# EAGLE design modular_expansion_basic_joystick_only (EAGLE 9.2.1)
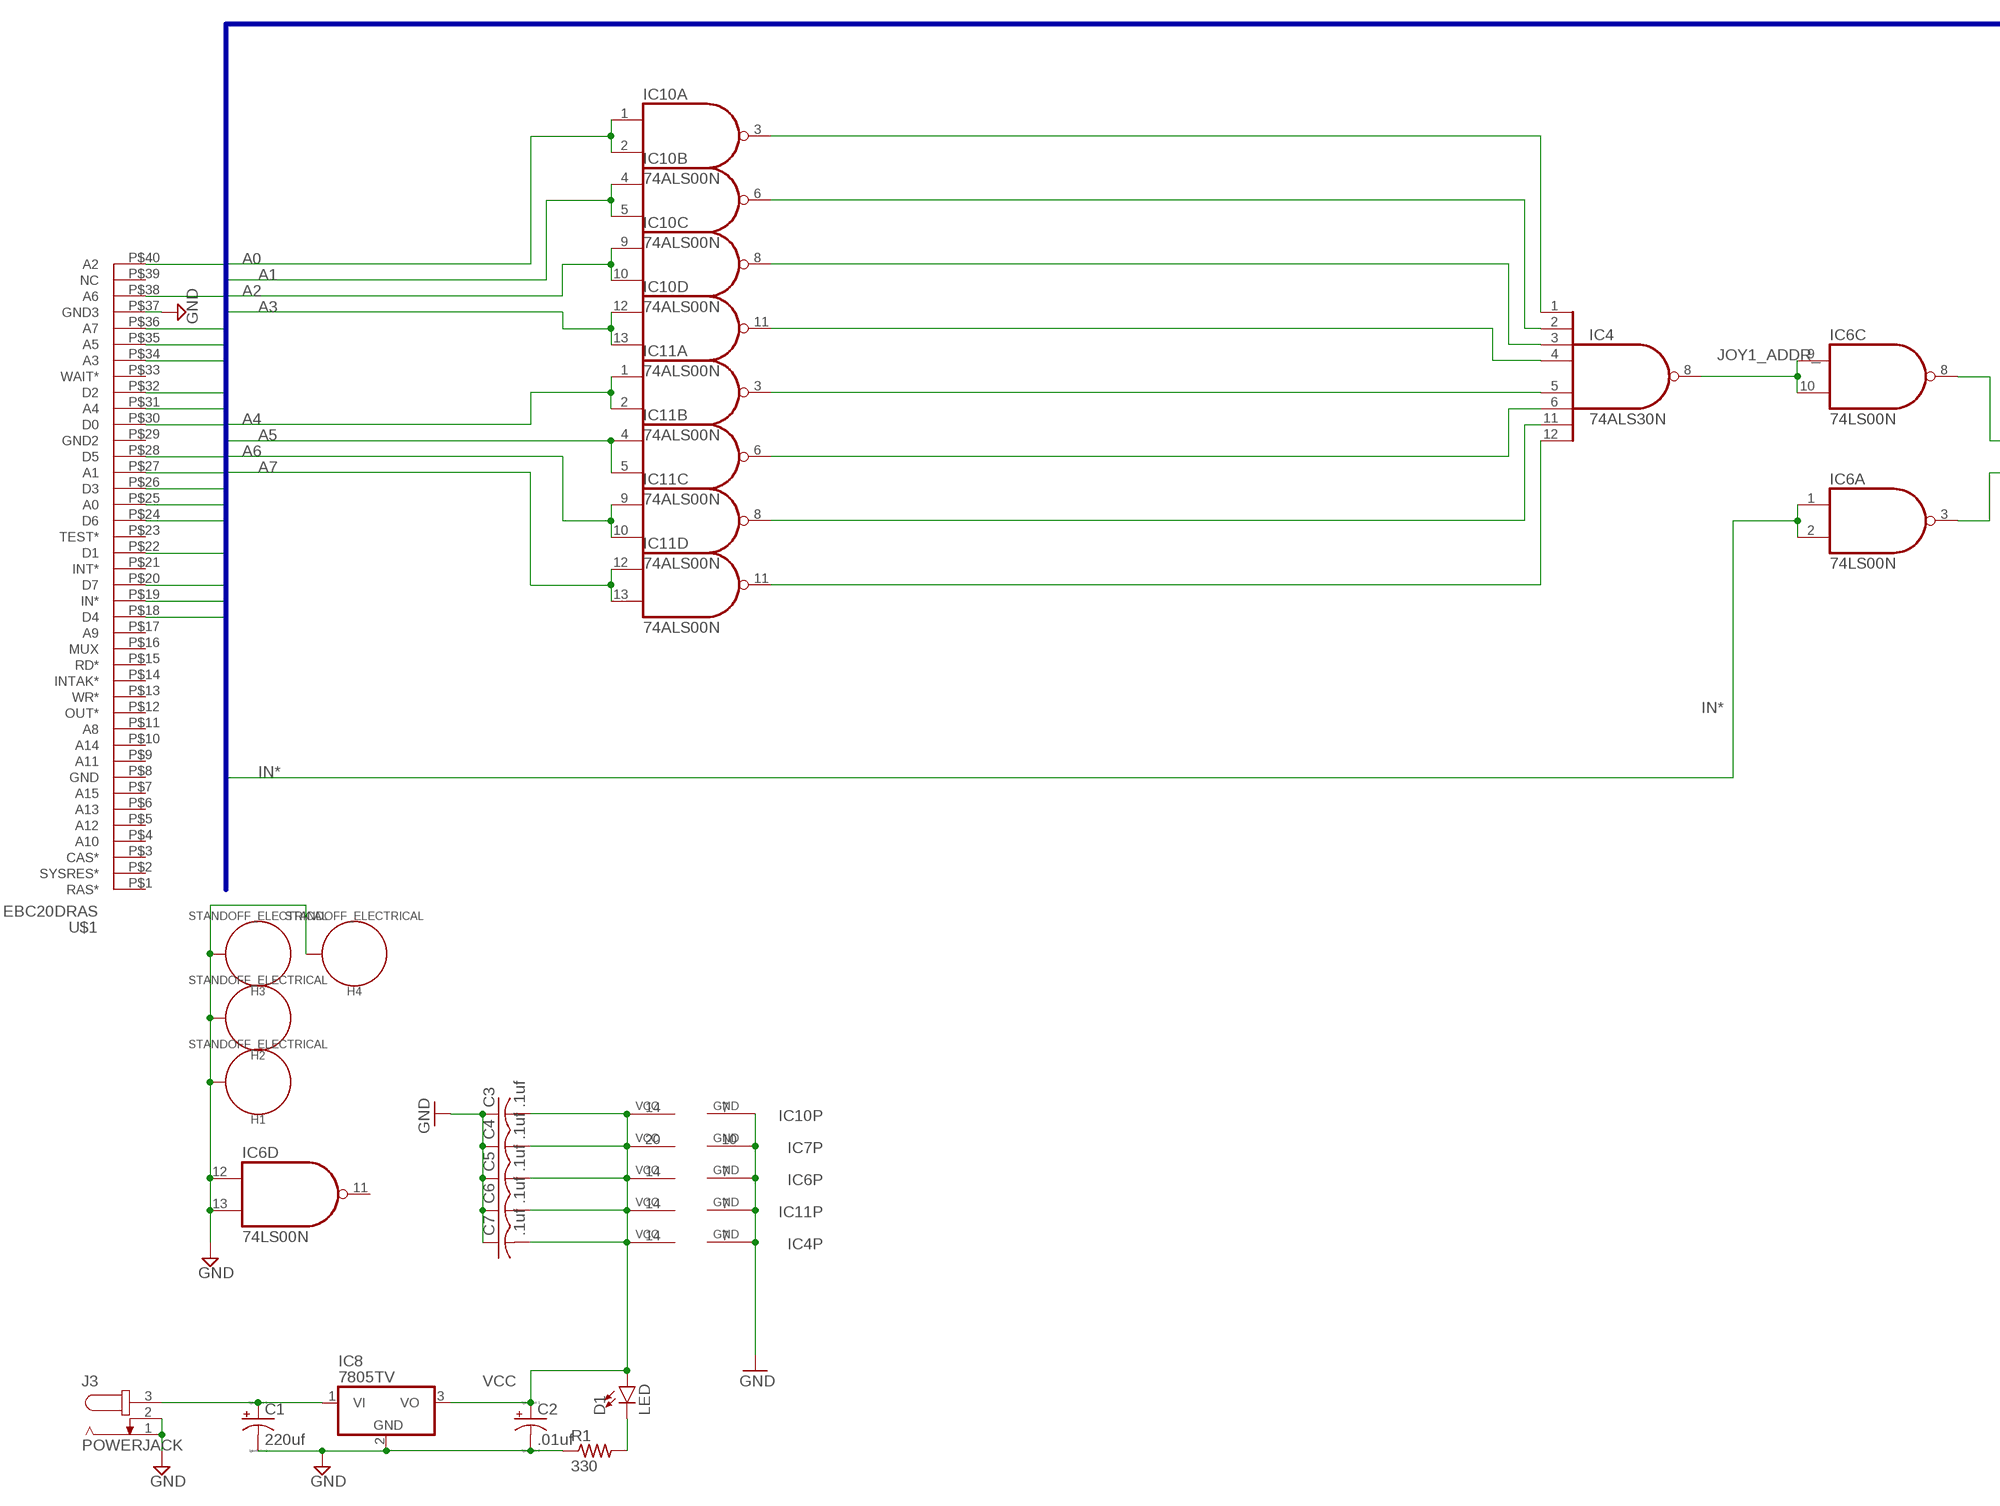
[diagram p0: schematic, sheet 1, part 1 of 2]
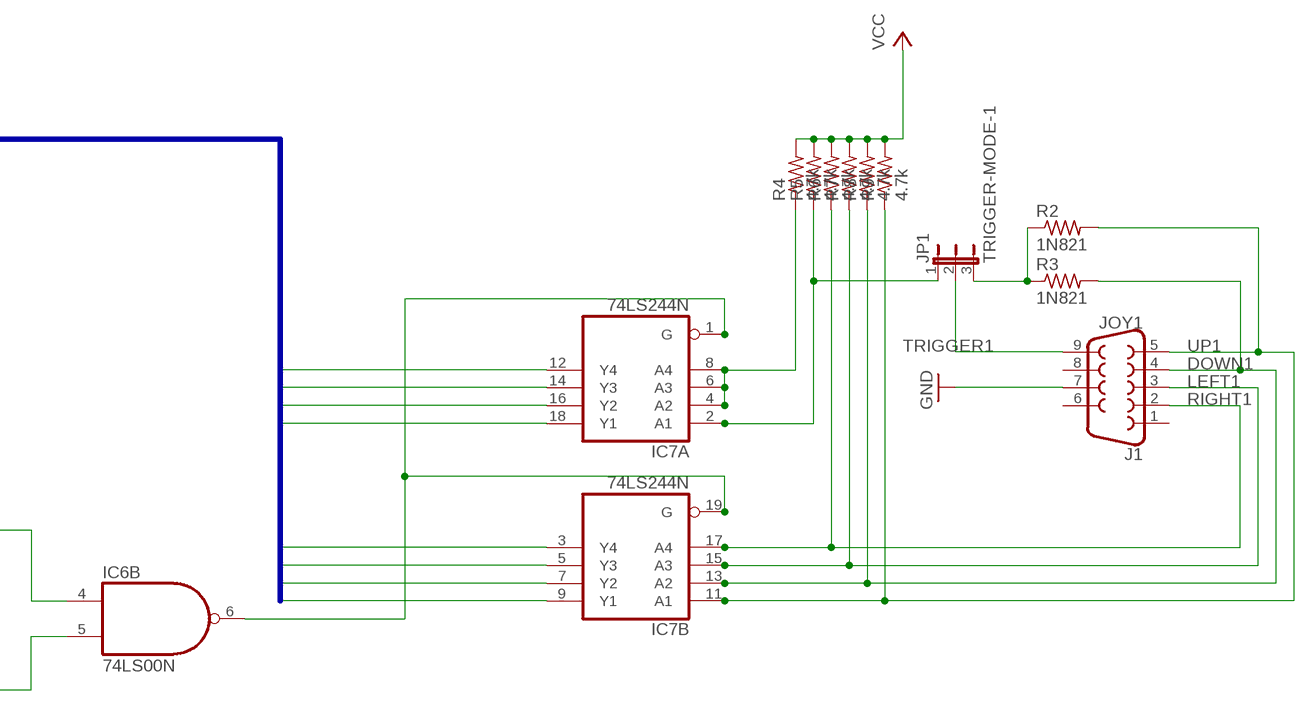
[diagram p1: schematic, sheet 1, part 2 of 2]

## Parts
C1  220uf  CPOL-USE3.5-10  [E3,5-10]
C2  .01uf  CPOL-USE2,5-6E  [E2,5-6E]
C3  .1uf  C-US025-025X050  [C025-025X050]
C4  .1uf  C-US025-025X050  [C025-025X050]
C5  .1uf  C-US025-025X050  [C025-025X050]
C6  .1uf  C-US025-025X050  [C025-025X050]
C7  .1uf  C-US025-025X050  [C025-025X050]
D1  LED  LED3MM  [LED_3MM]
H1  STANDOFF_ELECTRICAL  [STANDOFF-ELECTRICAL]
H2  STANDOFF_ELECTRICAL  [STANDOFF-ELECTRICAL]
H3  STANDOFF_ELECTRICAL  [STANDOFF-ELECTRICAL]
H4  STANDOFF_ELECTRICAL  [STANDOFF-ELECTRICAL]
IC4  74ALS30N  [DIL14]
IC6  74LS00N  [DIL14]
IC7  74LS244N  [DIL20]
IC8  7805TV  [TO220V]
IC10  74ALS00N  [DIL14]
IC11  74ALS00N  [DIL14]
J1  JOY1  DB9FEMALE  [DB9]
J3  POWERJACK  JACK-PLUG0  [SPC4077]
JP1  TRIGGER-MODE-1  JP2E  [JP2]
R1  330  R-US_0204/2V  [0204V]
R2  1N821  R-US_0204/2V  [0204V]
R3  1N821  R-US_0204/2V  [0204V]
R4  4.7k  R-US_0204/5  [0204/5]
R5  4.7k  R-US_0204/5  [0204/5]
R6  4.7k  R-US_0204/5  [0204/5]
R7  4.7k  R-US_0204/5  [0204/5]
R8  4.7k  R-US_0204/5  [0204/5]
R9  4.7k  R-US_0204/5  [0204/5]
U$1  EBC20DRAS  [EBC20DRAS]

## Nets
A0: IC10.1(A:I0) IC10.2(A:I1) U$1.P$25(A0)
A1: IC10.4(B:I0) IC10.5(B:I1) U$1.P$27(A1)
A2: IC10.9(C:I0) IC10.10(C:I1) U$1.P$40(A2)
A3: IC10.12(D:I0) IC10.13(D:I1) U$1.P$34(A3)
A4: IC11.1(A:I0) IC11.2(A:I1) U$1.P$31(A4)
A5: IC11.4(B:I0) IC11.5(B:I1) U$1.P$35(A5)
A6: IC11.9(C:I0) IC11.10(C:I1) U$1.P$38(A6)
A7: IC11.12(D:I0) IC11.13(D:I1) U$1.P$36(A7)
D0: IC7.9(B:Y1) U$1.P$30(D0)
D1: IC7.7(B:Y2) U$1.P$22(D1)
D2: IC7.5(B:Y3) U$1.P$32(D2)
D3: IC7.3(B:Y4) U$1.P$26(D3)
D4: IC7.18(A:Y1) U$1.P$18(D4)
D5: IC7.16(A:Y2) U$1.P$28(D5)
D6: IC7.14(A:Y3) U$1.P$24(D6)
D7: IC7.12(A:Y4) U$1.P$20(D7)
DOWN1: IC7.13(B:A2) J1.4 R3.2 R8.1
GND: C1.- C2.- C3.1 C4.1 C5.1 C6.1 C7.1 H1.P1 H2.P1 H3.P1 H4.P1 IC4.7(GND) IC6.7(P:GND) IC6.12(D:I0) IC6.13(D:I1) IC7.10(P:GND) IC8.2(GND) IC10.7(P:GND) IC11.7(P:GND) J1.7 J3.1 J3.2 R1.1 U$1.P$37(GND3)
IN*: IC6.1(A:I0) IC6.2(A:I1) U$1.P$19(IN*)
JOY1_ADDR_: IC4.8(O) IC6.9(C:I0) IC6.10(C:I1)
JOY1_SELECTED_: IC6.6(B:O) IC7.1(A:G) IC7.19(B:G)
LEFT1: IC7.15(B:A3) J1.3 R7.1
N$3: IC4.5(I4) IC11.3(A:O)
N$9: IC4.1(I0) IC10.3(A:O)
N$14: IC4.6(I5) IC11.6(B:O)
N$15: IC4.11(I6) IC11.8(C:O)
N$17: IC4.2(I1) IC10.6(B:O)
N$18: IC4.3(I2) IC10.8(C:O)
N$19: IC4.12(I7) IC11.11(D:O)
N$20: IC4.4(I3) IC10.11(D:O)
N$25: IC6.4(B:I0) IC6.8(C:O)
N$26: IC6.3(A:O) IC6.5(B:I1)
N$38: C1.+ IC8.1(VI) J3.3
N$39: JP1.3 R2.1 R3.1
N$41: D1.K(C) R1.2
N$43: IC7.4(A:A2) IC7.6(A:A3) IC7.8(A:A4) R4.1
N$44: IC7.2(A:A1) JP1.1 R5.1
RIGHT1: IC7.17(B:A4) J1.2 R6.1
TRIGGER1: J1.9 JP1.2
UP1: IC7.11(B:A1) J1.5 R2.2 R9.1
VCC: C2.+ C3.2 C4.2 C5.2 C6.2 C7.2 D1.A IC4.14(VCC) IC6.14(P:VCC) IC7.20(P:VCC) IC8.3(VO) IC10.14(P:VCC) IC11.14(P:VCC) R4.2 R5.2 R6.2 R7.2 R8.2 R9.2
Unconnected: IC6.11(D:O) J1.1 J1.6 J1.8 U$1.P$1(RAS*) U$1.P$2(SYSRES*) U$1.P$3(CAS*) U$1.P$4(A10) U$1.P$5(A12) U$1.P$6(A13) U$1.P$7(A15) U$1.P$8(GND) U$1.P$9(A11) U$1.P$10(A14) U$1.P$11(A8) U$1.P$12(OUT*) U$1.P$13(WR*) U$1.P$14(INTAK*) U$1.P$15(RD*) U$1.P$16(MUX) U$1.P$17(A9) U$1.P$21(INT*) U$1.P$23(TEST*) U$1.P$29(GND2) U$1.P$33(WAIT*) U$1.P$39(NC)

## Buses
EBC20DRAS:A0,A1,A2,A3,A4,A5,A6,A7,D0,D1,D2,D3,D4,D5,D6,D7,IN*,OUT*,RD*,WR*

## Library data of the parts
C1 C2 = resistor:CPOL-US: POLARIZED CAPACITOR, American symbol
C3-C7 = resistor:C-US: CAPACITOR, American symbol
D1 = SparkFun-LED:LED: LED (Generic) Standard schematic elements and footprints for 5mm, 3mm, 1206, and 0603 sized LEDs. Generic LEDs with no color specified.; PROD_ID: DIO-08794
H1-H4 = SparkFun-Hardware:STANDOFF_ELECTRICAL: Stand Off Drill holes with an electrical connection. For example, use these to ground your board to a chassis. Example SparkFun Products Screw - Phillips Head (1/4", 4-40, 10 pack) <https://www.sparkfun.com/products/10453> (PRT-10453) Screw - Phillips Head (1/2", 4-40, 10 pack) <https://www.sparkfun.com/products/10452> (PRT-10452) Screw - Phillips Head (3/4", 4-40, 10 pack) <https://www.sparkfun.com/products/10451> (PRT-10451) Screw - Phillips Head (1", 4-40, 10 pack) <https://www.sparkfun.com/products/10450> (PRT-10450)
IC4 = 74xx-us:74*30: 8-input NAND gate
IC6 IC10 IC11 = 74xx-us:74*00: Quad 2-input NAND gate
IC7 = 74xx-us:74*244: Octal BUFFER and LINE DRIVER, 3-state
IC8 = linear:78*: Positive VOLTAGE REGULATOR Source: http://cache.national.com/ds/LM/LM78L05.pdf http://www.fairchildsemi.com/ds/LM/LM7805.pdf
J1 = SparkFun-Connectors:DB9: DB9 Connector Standard DB9 (D-Sub 9) serial connector. Can be used for CAN bus as well as RS485 and RS232. Footprint production proven. Here is the female version connector we sell at SparkFun: 9 Pin Female Serial Connector - PCB Mount <https://www.sparkfun.com/products/429> (PRT-00429) This connector has been used on the following SparkFun products: SparkFun RS232 Shifter - SMD <https://www.sparkfun.com/products/449> (PRT-00449) SparkFun RS232 Shifter SMD (No DB9) <https://www.sparkfun.com/products/8780> (PRT-08780); PROD_ID: CONN-08194
J3 = con-jack:JACK-PLUG: DC POWER JACK Power Jack, DC, Right Angle, Through Hole, Rated 5A at 16VDC, PC Terminals Distributor: Farnell (www.Farnell.de) Drawing: 84N1161.pdf / 84N1162.pdf Manufacturer: SPC Technology (www.spctechnology.com) Type: SPC4077 / SPC 4078; OC_FARNELL: unknown; OC_NEWARK: unknown
JP1 = jumper:JP2E: JUMPER
R1 = resistor:R-US_: RESISTOR, American symbol
R2-R9 = rcl:R-US_: RESISTOR, American symbol; SPICEPREFIX: R
U$1 = TMS99:EBC20DRAS

## Board
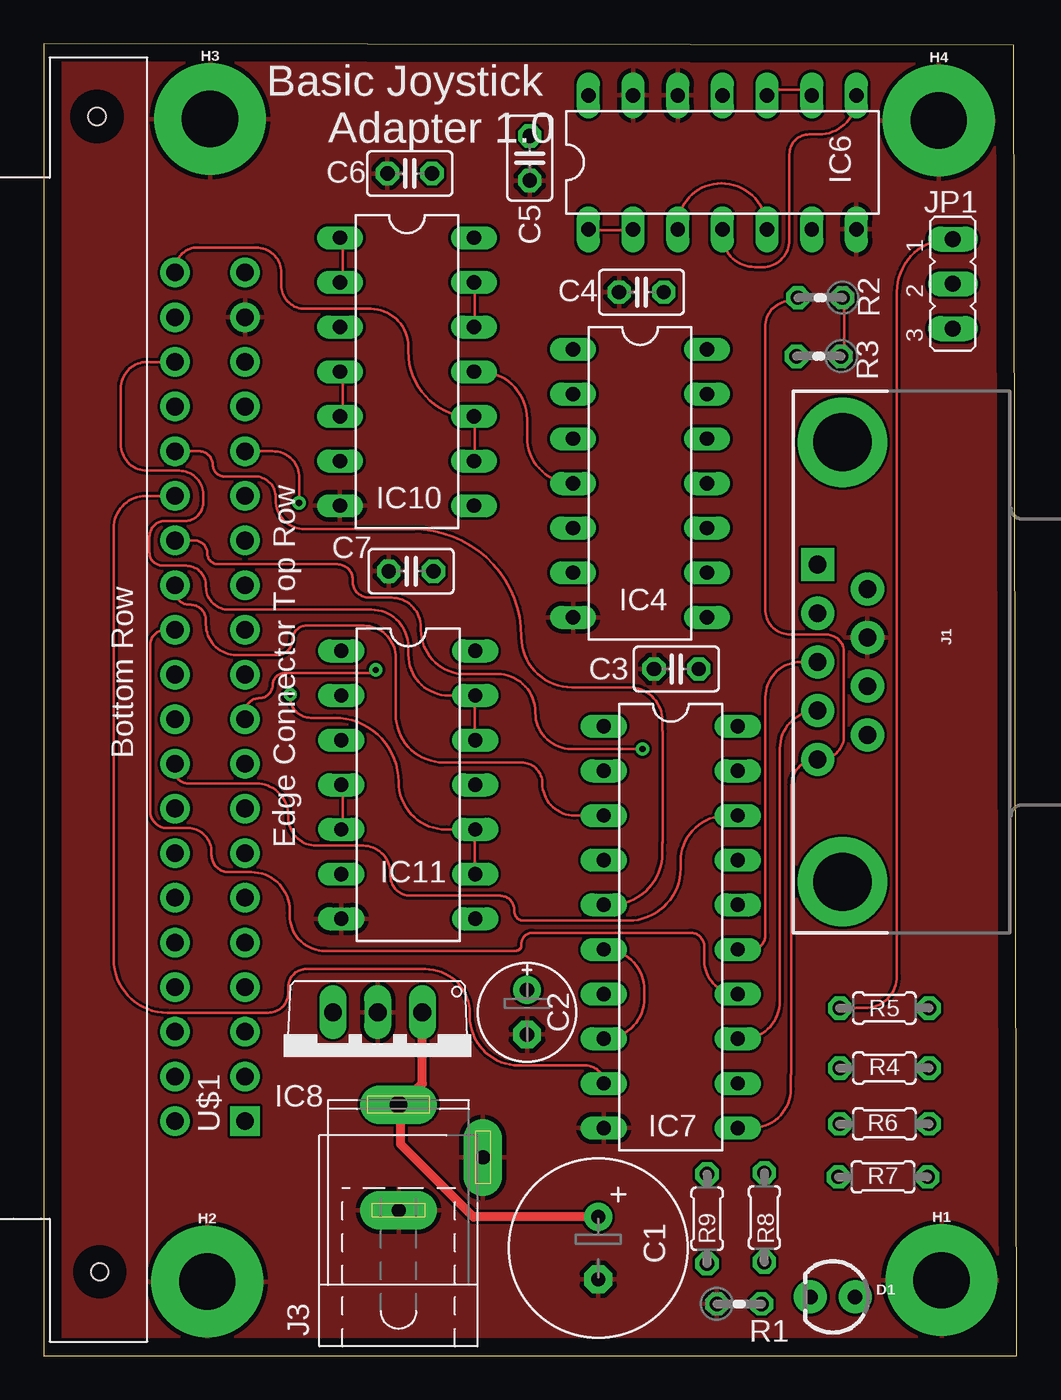
[diagram p2: board, top side]
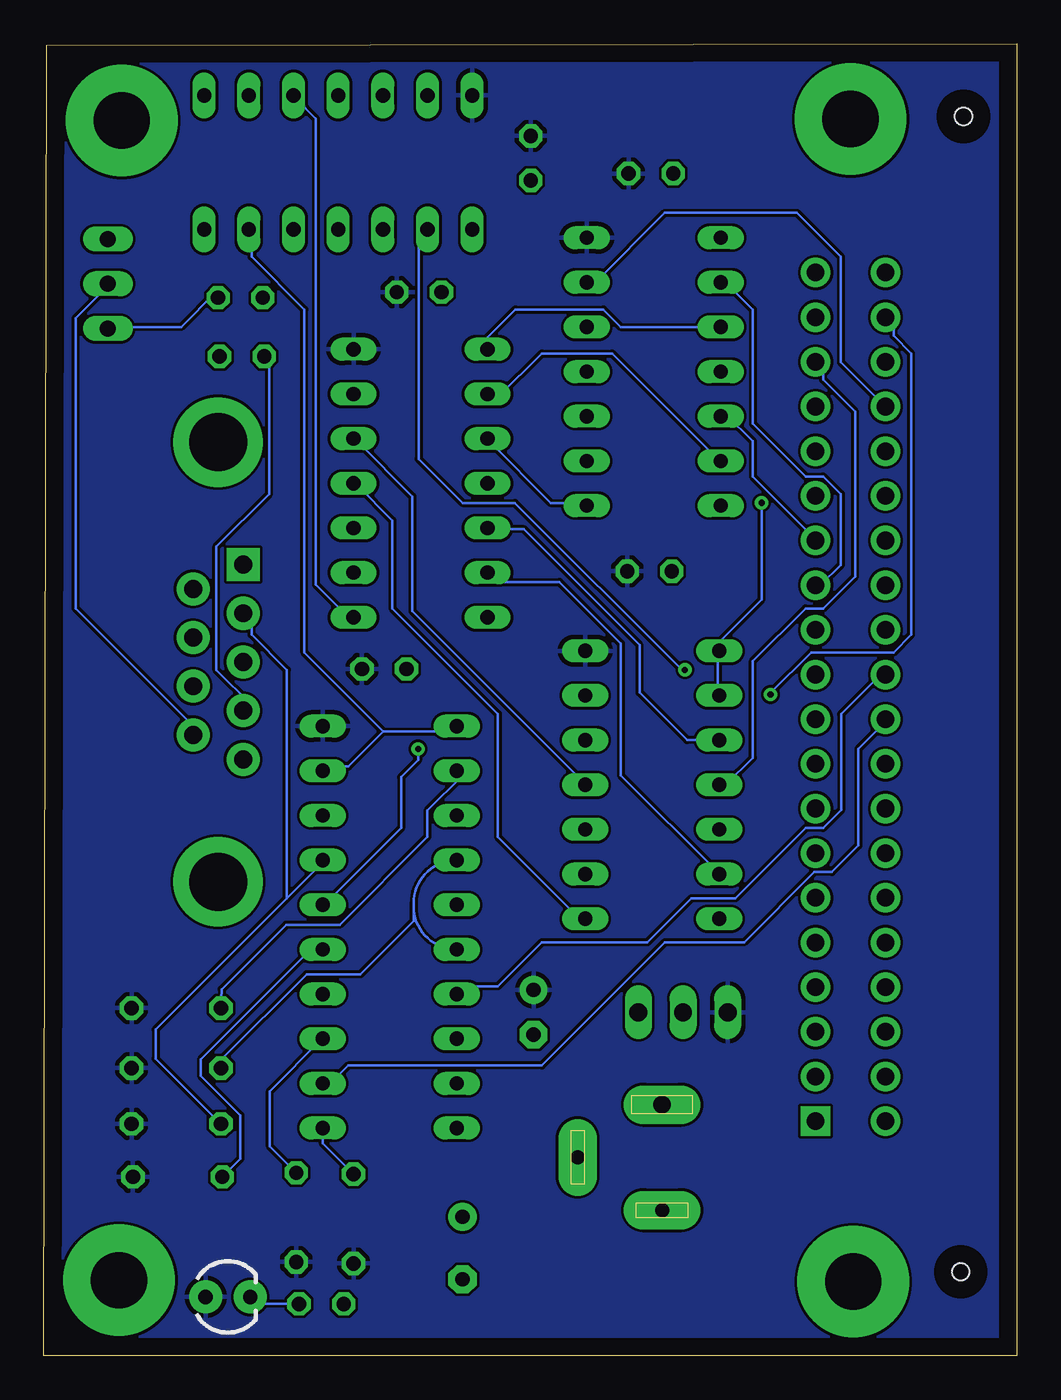
[diagram p3: board, bottom side, seen from below]

Size 55.3 x 74.6 mm. Coordinates in mm from the lower left corner, seen from the top.
Outline: 0,0 55.3,0 55.15,74.52 0,74.6 0,0
Copper layers (1*16): Top 0.035mm / dielectric 1.5mm / Bottom 0.035mm
Design rules "default": minimum track width 6mil, minimum drill 0.35mm, track to track 6mil, track to pad 6mil, pad to pad 6mil, via to via 6mil, smd to smd 6mil, copper to edge 40mil, drill to drill 6mil, minimum pad ring 10mil, minimum via ring 8mil, stop-mask expansion 4mil, vias tented up to drill 0mil, thermal gap 10mil

### Footprints (pad centres in the part's own frame; a part is rotated, then mirrored left to right if it is on the bottom)
E3,5-10 = drill 0.813 pad 1.6: + -1.778,0 | drill 0.813 pad 1.6 octagon: - 1.778,0
E2,5-6E = drill 0.813 pad 1.575: + -1.27,0 | drill 0.813 pad 1.575 octagon: - 1.27,0
C025-025X050 = drill 0.813 octagon: 1 -1.27,0; 2 1.27,0
LED_3MM = drill 0.813 pad 1.88: A -1.27,0; K 1.27,0
STANDOFF-ELECTRICAL = drill 3.2 pad 6.35: P1 0,0
DIL14 = drill 0.813 long: 1 -7.62,-3.81; 2 -5.08,-3.81; 3 -2.54,-3.81; 4 0,-3.81; 5 2.54,-3.81; 6 5.08,-3.81; 7 7.62,-3.81; 8 7.62,3.81; 9 5.08,3.81; 10 2.54,3.81; 11 0,3.81; 12 -2.54,3.81; 13 -5.08,3.81; 14 -7.62,3.81
DIL20 = drill 0.813 long: 1 -11.43,-3.81; 2 -8.89,-3.81; 3 -6.35,-3.81; 4 -3.81,-3.81; 5 -1.27,-3.81; 6 1.27,-3.81; 7 3.81,-3.81; 8 6.35,-3.81; 9 8.89,-3.81; 10 11.43,-3.81; 11 11.43,3.81; 12 8.89,3.81; 13 6.35,3.81; 14 3.81,3.81; 15 1.27,3.81; 16 -1.27,3.81; 17 -3.81,3.81; 18 -6.35,3.81; 19 -8.89,3.81; 20 -11.43,3.81
TO220V = drill 1.016 long: 1 -2.54,-2.54; 2 0,-2.54; 3 2.54,-2.54
DB9 = drill 1.016 pad 1.88 square: 1 -5.54,-1.42 | drill 1.016 pad 1.88: 2 -2.77,-1.42; 3 0,-1.42; 4 2.77,-1.42; 5 5.54,-1.42; 6 -4.15,1.42; 7 -1.38,1.42; 8 1.38,1.42; 9 4.15,1.42 | drill 3.302 pad 5.08: G1 -12.5,0; G2 12.5,0
SPC4077 = drill 0.8 pad 2.184 long: 1 -3,0; 2 0,-4.8 | drill 1 pad 2.184 long: 3 3,0
JP2 = drill 0.914 long: 1 -2.54,0; 2 0,0; 3 2.54,0
0204V = drill 0.813 octagon: 1 -1.27,0; 2 1.27,0
0204/5 = drill 0.813 octagon: 1 -2.54,0; 2 2.54,0
EBC20DRAS = drill 1 pad 1.676 square: P$1 0,0 | drill 1 pad 1.676: P$2 0,3.969; P$3 2.54,0; P$4 2.54,3.969; P$5 5.08,0; P$6 5.08,3.969; P$7 7.62,0; P$8 7.62,3.969; P$9 10.16,0; P$10 10.16,3.969; P$11 12.7,0; P$12 12.7,3.969; P$13 15.24,0; P$14 15.24,3.969; P$15 17.78,0; P$16 17.78,3.969; P$17 20.32,0; P$18 20.32,3.969; P$19 22.86,0; P$20 22.86,3.969; P$21 25.4,0; P$22 25.4,3.969; P$23 27.94,0; P$24 27.94,3.969; P$25 30.48,0; P$26 30.48,3.969; P$27 33.02,0; P$28 33.02,3.969; P$29 35.56,0; P$30 35.56,3.969; P$31 38.1,0; P$32 38.1,3.969; P$33 40.64,0; P$34 40.64,3.969; P$35 43.18,0; P$36 43.18,3.969; P$37 45.72,0; P$38 45.72,3.969; P$39 48.26,0; P$40 48.26,3.969 | hole 1: -8.572,8.255; 57.15,8.414

### Placement (x,y rotation side)
C1  31.51,6.11 270 top
C2  27.46,19.53 270 top
C3  35.96,39.05 0 top
C4  33.97,60.48 0 top
C5  27.62,68.1 90 top
C6  20.8,67.23 0 top
C7  20.88,44.61 0 top
D1  44.85,3.33 180 top
H1  51.04,4.29 0 top
H2  9.29,4.21 0 top
H3  9.45,70.33 0 top
H4  50.88,70.25 0 top
IC4  33.89,49.61 270 top
IC6  38.58,67.87 0 top
IC7  35.64,24.37 270 top
IC8  18.97,16.99 180 top
IC10  20.64,55.96 270 top
IC11  20.72,32.46 270 top
J1  45.4,39.45 270 top
J3  20.16,11.27 90 top
JP1  51.67,60.96 270 top
R1  39.53,2.94 0 top
R2  44.13,60.17 180 top
R3  44.05,56.83 180 top
R4  47.78,16.35 0 top
R5  47.78,19.76 0 top
R6  47.78,13.18 0 top
R7  47.7,10.16 0 top
R8  40.96,7.86 270 top
R9  37.7,7.78 270 top
U$1  11.43,13.34 90 top

### Tracks (layer width: path | path; a pad name or v marks a point on that pad's centre or on a via)
A0
  Top 0.152: IC10.2 17,61.5 17,63.5 IC10.1
  Bottom 0.152: U$1.P$25 11.15,43.81 10,44.97 10,49 11,50 12,50 15,53 15,59.5 16.5,61 IC10.2
A1
  Top 0.152: IC10.5 17,53.5 17,55.5 IC10.4
  Bottom 0.152: U$1.P$27 11.5,46.5 15,50 15,52 16.5,53.5 IC10.5
A2
  Top 0.152: IC10.9 24.5,51 24.5,53 24.46,53.35 | 24.46,53.35 IC10.10 | U$1.P$40 7.46,61.75 arc-90 8.73,63.02 12.06,63.02 arc-90 13.49,61.59 13.49,60.88 arc90 14.84,59.53 18.57,59.53 arc-90 20.72,57.39 20.72,57.09 arc90 24.46,53.35
A3
  Top 0.152: IC10.12 24.5,58.5 24.5,61 IC10.13
  Bottom 0.152: U$1.P$34 7.5,54 10,56.5 10,62.5 12.5,65 20,65 24,61 IC10.13
A4  (via drill 0.35)
  Top 0.152: U$1.P$31 13.02,51.44 arc-90 14.53,49.93 14.53,48.53 arc-90 v14.5,48.5
  Bottom 0.152: IC11.2 17,38 17,40 IC11.1 17,40.5 14.5,43 v14.5,48.5
A5
  Top 0.152: IC11.5 17,30 17,32 IC11.4
  Bottom 0.152: U$1.P$35 11,56.5 11,55.5 9.18,53.68 9.18,44.32 11,42.5 12,42.5 15,39.5 15,34 16.5,32.5 IC11.4
A6  (via drill 0.35)
  Top 0.152: IC11.9 24.5,27.5 24.5,29.5 24.52,29.84 | 24.52,29.84 IC11.10 | v14,37.6 14,37.44 arc90 15.16,36.27 16.51,36.27 arc-90 20.16,32.62 arc90 22.86,29.92 24.44,29.92 arc-90 24.52,29.84
  Bottom 0.152: v14,37.6 14,37.68 11.68,40 7,40 6,41 6,57 7,58 7,59 U$1.P$38
A7
  Top 0.152: IC11.12 24.5,35.5 24.5,37.5 arc90 24.46,37.54 | U$1.P$36 5.87,56.52 arc90 4.37,55.01 4.37,51.83 arc90 5.87,50.32 7.7,50.32 arc-90 9.05,48.97 9.05,48.5 arc-90 8.02,47.47 6.87,47.47 arc90 6,46.59 6,45.67 arc90 6.75,44.93 8.07,44.93 arc-90 8.08,44.92 arc-90 9.21,43.79 9.21,43.74 arc90 10.52,42.42 18.62,42.42 arc-90 20.72,40.32 20.72,39.85 arc90 23.02,37.54 24.46,37.54 | IC11.13 24.46,37.54
D0
  Top 0.152: U$1.P$30 5.79,48.9 arc90 3.97,47.07 3.97,22.53 arc90 7,19.5 12.75,19.5 arc90 13.89,20.64 13.89,20.95 arc-90 14.92,21.99 21.67,21.99 arc-90 24.21,19.45 24.21,19.29 arc90 27,16.5 30.81,16.5 arc-90 IC7.9
D1
  Bottom 0.152: U$1.P$22 7.72,38.73 9.98,36.48 9.98,31.02 11,30 12,30 16,26 18.5,26 21,23.5 27,23.5 29.5,21 31.5,21 IC7.7
D2
  Top 0.152: U$1.P$32 8.81,51.44 arc-90 9.6,50.64 arc90 10.25,50 12,50 arc-90 13.18,48.82 13.18,48.66 arc90 14.83,47 21.02,47 arc-90 27.15,40.88 arc90 30.02,38 33.28,38 arc-90 35.16,36.12 35.16,35.54 arc90 35.19,35.51 35.19,29.19 arc90 35.16,29.16 35.16,28.57 arc-90 32.23,25.64 IC7.5
D3
  Top 0.152: U$1.P$26 7.46,43.5 arc90 8.26,42.7 8.33,42.7 arc-90 9.21,41.83 9.21,41.59 arc90 10.95,39.85 13.26,39.85 arc90 14.13,40.72 arc-90 14.92,41.51 18.18,41.51 arc-90 20,39.69 20,36.47 arc90 22.73,33.73 27.15,33.73 arc-90 28.34,32.54 arc90 30.16,30.72 IC7.3
D4
  Top 0.152: U$1.P$18 7.46,33.26 arc90 8.18,32.54 12.06,32.54 arc-90 13.89,30.72 13.89,30.61 arc90 15.5,29 18.15,29 arc-90 19.68,27.46 19.68,27.32 arc90 20.84,26.16 25.91,26.16 arc-90 26.75,25.32 26.75,25.25 arc90 27.26,24.74 33.23,24.74 arc90 36.2,27.7 36.2,28.1 arc-90 38.81,30.72 IC7.18
D5  (via drill 0.35)
  Top 0.152: v34.03,34.5 30,34.5 arc-90 27.94,36.56 27.94,36.59 arc90 25.77,38.76 23.94,38.76 arc-90 21.43,41.27 21.43,41.43 arc90 19.76,43.1 18.49,43.1 arc-90 17.55,44.05 17.55,44.12 17.55,44.14 arc90 16.68,45.01 9.92,45.01 arc-90 9.29,45.64 arc90 8.57,46.35 U$1.P$28
  Bottom 0.152: v34.03,34.5 34.03,33.87 35,32.9 35,30 39,26 IC7.16
D6
  Top 0.152: U$1.P$24 6.91,41.27 arc90 6.03,40.4 6.03,30.97 arc90 7,30 8.18,30 arc-90 9.53,28.65 9.53,28.48 arc90 10.5,27.5 11.79,27.5 arc-90 13.97,25.32 13.97,25.03 arc90 15.98,23.02 26.83,23.02 arc90 27.15,23.34 27.15,23.42 arc-90 27.78,24.05 36.75,24.05 arc-90 37.54,23.26 37.54,22.46 arc90 IC7.14
D7
  Bottom 0.152: IC7.12 39,15.5 38,16.5 27,16.5 20,23.5 15.5,23.5 11.5,27.5 10.5,27.5 9,29 9,34.5 7.5,36 U$1.P$20
DOWN1
  Top 0.152: IC7.13 39.73,18.02 arc90 41.84,20.13 41.84,34.54 arc-90 J1.4
  Bottom 0.152: IC7.13 39.5,18 42.46,15.04 42.46,11.9 R8.1 | R3.2 42.5,56.5 42.5,49 45.5,46 45.5,39 43.5,37 J1.4
GND
  pour Top: 0,0 55.24,0 55.24,74.61 0,74.61
IN*  (via drill 0.35)
  Top 0.152: IC6.1 31,64 33,64 IC6.2 | v18.86,39 arc-90 18.68,38.81 13.65,38.81 arc90 13.02,38.18 arc-90 12.22,37.39 arc90 11.43,36.59 U$1.P$19
  Bottom 0.152: v18.86,39 19.02,39 28.52,48.5 31.5,48.5 34,51 34,63.5 33.5,64 IC6.2
JOY1_ADDR_
  Top 0.152: IC6.9 43.5,72 41.5,72 IC6.10
  Bottom 0.152: IC4.8 38,42 39.84,43.84 39.84,70.34 41,71.5 IC6.10
JOY1_SELECTED_
  Bottom 0.152: 36,35.5 32,35.5 IC7.1 | 36,35.5 38,33.5 39,33.5 IC7.19 | 36,35.5 40.5,40 40.5,59.5 43.5,62.5 43.5,64 IC6.6
LEFT1
  Top 0.152: IC7.15 40.2,23.1 arc90 41.02,23.92 41.02,37.45 arc-90 43.02,39.45 J1.3
  Bottom 0.152: IC7.15 39.5,23.5 39.73,23.5 46.39,16.84 46.39,15.92 44.13,13.66 44.13,11.19 R7.1
N$3
  Bottom 0.152: IC4.5 30,47 28.02,47 21.43,40.41 21.43,37.7 18.73,35 IC11.3
N$9
  Bottom 0.152: IC10.3 17,58.5 22.5,58.5 23.5,59.5 28.5,59.5 30.5,57.5 IC4.1
N$14
  Bottom 0.152: IC11.6 17,27.5 22.5,33 22.5,40.5 26,44 29.5,44 30,44.5 IC4.6
N$15
  Bottom 0.152: IC11.8 25,25 29.5,29.5 29.5,36.5 35.5,42.5 35.5,47.5 37.5,49.5 IC4.11
N$17
  Bottom 0.152: IC10.6 17,51 23,57 27,57 29.5,54.5 30,54.5 IC4.2
N$18
  Bottom 0.152: IC10.8 24.5,48.5 26.5,48.5 30,52 IC4.3
N$19
  Bottom 0.152: IC11.11 24.53,32.5 34.37,42.34 34.37,48.87 37.5,52 IC4.12
N$20
  Top 0.152: IC10.11 24.77,55.96 arc-90 27.46,53.26 27.46,52.23 arc90 IC4.4
N$25
  Top 0.152: IC6.8 46.2,71.6 arc-90 44.05,69.45 43.5,69.45 arc90 42.39,68.34 42.39,63.44 arc-90 40.86,61.91 40.4,61.91 arc-90 38.58,63.74 IC6.4
N$26
  Top 0.152: IC6.3 36.04,64.21 arc-90 38.5,66.67 arc-90 IC6.5
N$38
  Top 0.152: J3.3 20.5,14.5 20.52,14.48
  Top 0.508: IC8.1 21.51,15.48 20.52,14.48 20.28,14.25 20.28,12.03 24.42,7.89 C1.+
N$39
  Top 0.152: R3.1 45.5,57 45.5,60 R2.1
  Bottom 0.152: JP1.3 51.5,58.5 47.5,58.5 45.5,60.5 R2.1
N$41
  Bottom 0.152: R1.2 43.18,2.94 D1.K
N$43
  Top 0.152: IC7.8 arc90 34.13,20.32 34.13,20.8 arc90 IC7.6
  Bottom 0.152: IC7.4 arc-90 34.29,25.72 34.29,25.56 | IC7.6 arc90 34.29,25.56 | 34.29,25.56 34.29,24.71 37.32,21.68 40.37,21.68 45.24,16.8 R4.1
N$44
  Top 0.152: JP1.1 51.5,63.5 arc90 48.5,60.5 48.5,21.59 arc-90 46.67,19.76 R5.1
  Bottom 0.152: R5.1 45.2,20.84 41.53,24.5 38.5,24.5 33.5,29.5 33.5,31 31.5,33 IC7.2
RIGHT1
  Bottom 0.152: 41.5,26 39.5,28 IC7.17 | 41.5,26 48.95,18.55 48.95,16.89 R6.1 | 41.5,26 41.5,39 43.5,41 43.5,42 J1.2
TRIGGER1
  Bottom 0.152: JP1.2 52,60.5 53.5,59 53.5,42.5 46.5,35.5 J1.9
UP1
  Top 0.152: R2.2 42.5,60 arc90 41,58.5 41,42.47 arc90 42.47,41 44.5,41 arc-90 45.48,40.02 45.48,35.24 arc-90 44.15,33.91 J1.5 arc90 42.5,32.43 42.5,16 arc90 42.47,15.97 42.47,15.16 arc-90 40.24,12.94 IC7.11
  Bottom 0.152: R9.1 39.45,12.06 IC7.11
VCC
  pour Bottom: 0.16,0 55.32,0 55.32,74.61 0.16,74.61

### Text on the board
tNames: Basic Joystick / Adapter 1.0